# Altium schematic sheet RT-TI DC-DC 5V-LMR14030.SchDoc
size A4
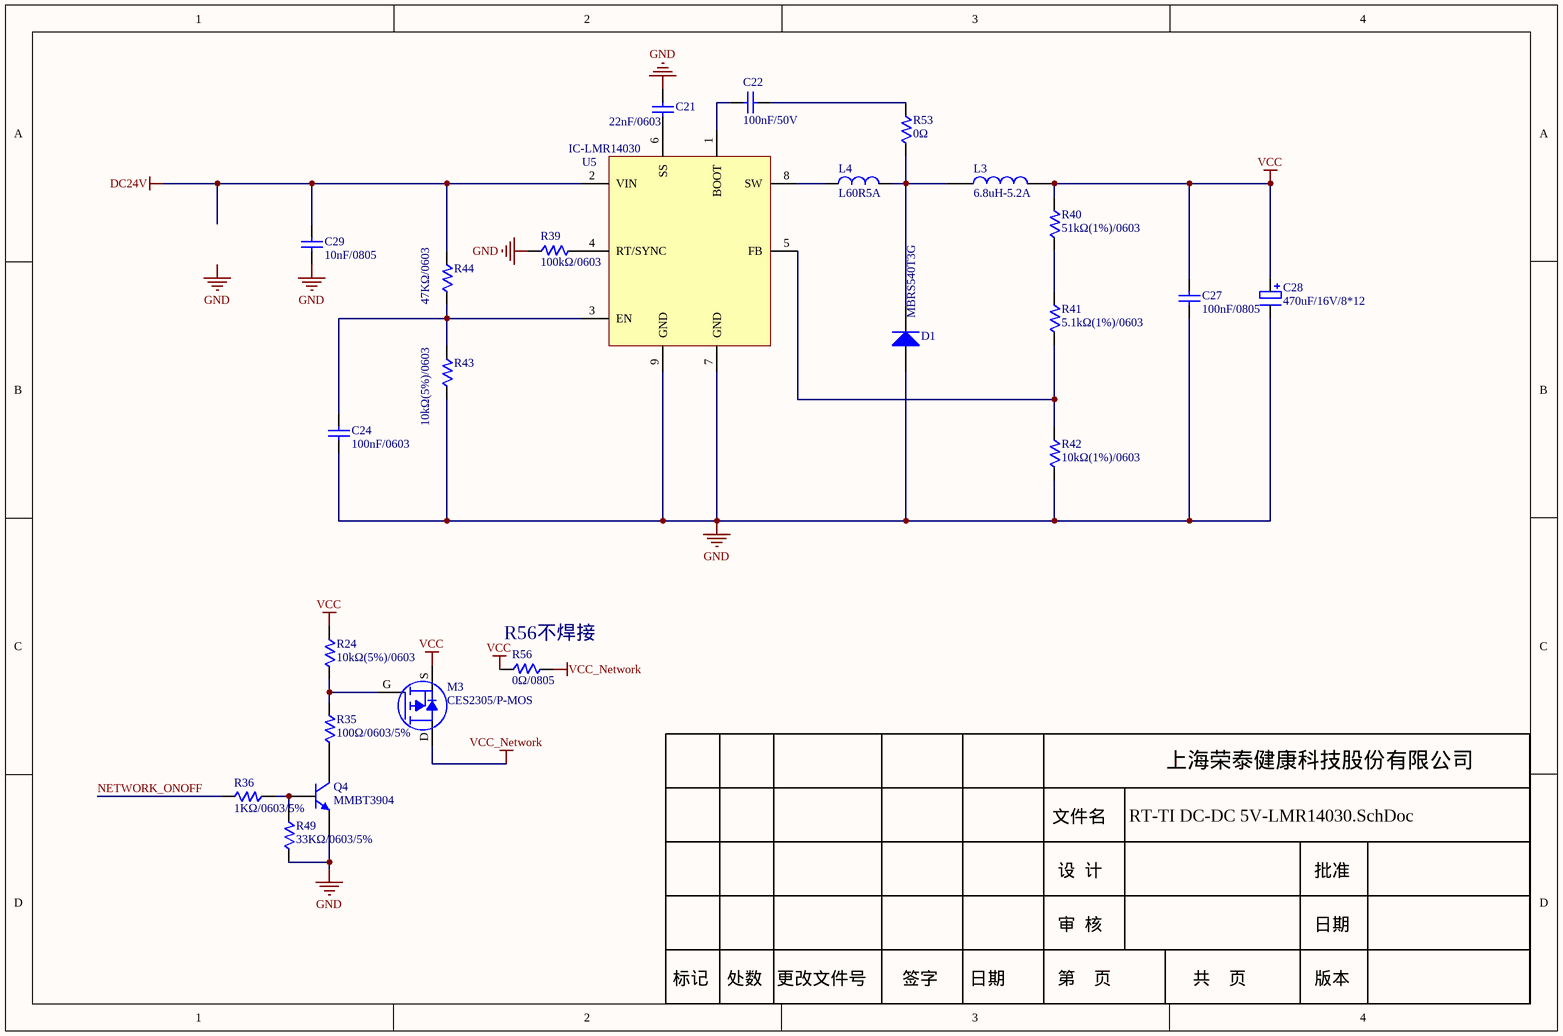
[diagram p0: RT-TI DC-DC 5V-LMR14030.SchDoc]

## Parts
C21  22nF/0603  [0603c]
C22  100nF/50V  [0603C]
C24  100nF/0603  [0603C]
C27  100nF/0805  [0805C]
C28  470uF/16V/8*12  [RB.15/.35]
C29  10nF/0805  [0805C]
D1  MBRS540T3G  [DO-214Ab]
L3  6.8uH-5.2A  [LH-11*11]
L4  L60R5A  [0805L]
M3  CES2305/P-MOS  [SOT-23C]
Q4  MMBT3904  [SOT-23-N]
R24  10kΩ(5%)/0603  [0603]
R35  100Ω/0603/5%  [0603]
R36  1KΩ/0603/5%  [0603]
R39  100kΩ/0603  [0603]
R40  51kΩ(1%)/0603  [0603]
R41  5.1kΩ(1%)/0603  [0603]
R42  10kΩ(1%)/0603  [0603]
R43  10kΩ(5%)/0603  [0603]
R44  47KΩ/0603  [0603]
R49  33KΩ/0603/5%  [0603]
R53  0Ω  [0603]
R56  0Ω/0805  [0805]  (no BOM)
U5  IC-LMR14030  [SO-8-2]

## Nets
DC24V: C29.1 R44.2 U5.2(VIN)
GND: C21.1 C24.1 C27.1 C28.2 C29.2 D1.1(A) Q4.E R39.2 R42.1 R43.1 R49.1 U5.7(GND) U5.9(GND)
VCC: C27.2 C28.1 L3.2 M3.S R24.2 R40.2 R56.2
VCC_Network: M3.D R56.1
NETWORK_ONOFF: R36.1
NetC21_2: C21.2 U5.6(SS)
NetC22_1: C22.1 U5.1(BOOT)
NetC22_2: C22.2 R53.2
NetC24_2: C24.2 R43.2 R44.1 U5.3(EN)
NetD1_2: D1.2(K) L3.1 L4.2 R53.1
NetL4_1: L4.1 U5.8(SW)
NetM3_G: M3.G R24.1 R35.2
NetQ4_B: Q4.B R36.2 R49.2
NetQ4_C: Q4.C R35.1
NetR39_1: R39.1 U5.4(RT/SYNC)
NetR40_1: R40.1 R41.2
NetR41_1: R41.1 R42.2 U5.5(FB)

## Notes on the sheet
- (near R56) R56不焊接
- Labels drawn without touching a wire or pin: GND
- 上海荣泰健康科技股份有限公司
- 文件名
- 设  计
- 批准
- 标记
- 处数
- 更改文件号
- 签字
- 日期
- 审  核
- 第    页
- 共    页
- 版本

## Library data of the parts
C21 = C0603/22nF: 物料名称: 贴片电容22nF/(10%)/X7R/0603封装/环保; 物料编号: 1.01.25.052; 领料单位: 电子车间; 单位: 个; 仓库/库位: 内5X
C22 = C0603/100nF/50V: 物料名称: 贴片电容100nF/(10%)X7R/0603封装/环保; 物料编号: 1.01.25.068; 领料单位: 电子车间; 单位: 个; 仓库/库位: 内5X
C24 = C0603/100nF: 物料名称: 贴片电容104M/(20%)/X7R/0603封装/环保; 物料编号: 1.01.25.056; 领料单位: 电子车间; 单位: 个; 仓库/库位: 内5X
C27 = C0805/104M: 物料名称: 贴片电容104M/50V/0805封装/20%/X7R/环保; 物料编号: 1.01.25.003; 领料单位: 电子车间; 单位: 个; 仓库/库位: 内5X
C28 = 电解电容470uF/16V/8*12/编带/环保: 物料编号: 1.01.21.034; 领料单位: 电子车间; 单位: 个; 仓库/库位: 内5X; 物料名称: 电解电容470uF/16V/8*12/编带/环保
C29 = C0805/103/50V: 物料名称: 贴片电容103/50V/0805封装/10%/X7R/环保; 物料编号: 1.01.25.018; 领料单位: 电子车间; 单位: 个; 仓库/库位: 内5X
D1 = D-MBRS540T3G: 物料名称: 贴片二极管MBRS540T3G/5A 40V/ DO-214AB封装/环保; 物料编号: 新物料; 领料单位: 电子车间; 单位: 个; 仓库/库位: 内5X
L3 = L-6.8uH-5.2A/10*10/环保: 物料名称: 6.8uH-5.2A/贴片功率电感/10*10/环保; 物料编号: 新物料; 领料单位: 电子车间; 单位: 个; 仓库/库位: 内5X
L4 = L0603/60R5A: 物料名称: 贴片磁珠/FBMA-11-201209-600A50T/0805A封装/环保/EMC; 物料编号: 1.01.51.080; 领料单位: 电子车间; 单位: 个; 仓库/库位: 内5X
M3 = P沟道mos管CES2305封装SOT-23/环保: 物料编号: 1.01.40.512; 物料名称: P沟道mos管CES2305封装SOT-23/环保
Q4 = Q-MMBT3904/1AM-N: 物料名称: 贴片三极管1AM/MMBT3904/sot-23封装环保; 物料编号: 1.01.33.013; 领料单位: 电子车间; 单位: 个; 仓库/库位: 内5X
R24 R43 = R0603/10kΩ/(5%): 物料编号: 1.01.15.105; 物料名称: 贴片电阻10kΩ/(5%)0603封装/环保; 领料单位: 个; 仓库/库位: 内5X
R35 = 贴片电阻100Ω/(5%)0603封装: 物料编号: 1.01.15.103; 领料单位: 电子车间; 仓库/库位: 内5X; 单位: 个; 物料名称: 贴片电阻100Ω/(5%)0603封装
R36 = 贴片电阻1K/(5%)/0603封装/环保: 物料编号: 1.01.15.111; 领料单位: 电子车间; 单位: 个; 仓库/库位: 内5X; 物料名称: 贴片电阻1K/(5%)/0603封装/环保
R39 = R0603/100K: 物料编号: 1.01.15.123; 物料名称: 贴片电阻100kΩ(1%)/0603封装/环保; 领料单位: 电子车间; 单位: 个; 仓库/库位: 内5X
R40 = R0603/51kΩ(1%): 物料编号: 新物料; 物料名称: 贴片电阻51kΩ(1%)/0603封装/环保; 领料单位: 电子车间; 单位: 个; 仓库/库位: 内5X
R41 = R0603/5.1kΩ(1%): 物料编号: 新物料; 物料名称: 贴片电阻5.1kΩ(1%)/0603封装/环保; 领料单位: 电子车间; 单位: 个; 仓库/库位: 内5X
R42 = R0603/10kΩ(1%): 物料编号: 1.01.15.112; 物料名称: 贴片电阻10kΩ(1%)/0603封装/环保; 领料单位: 电子车间; 单位: 个; 仓库/库位: 内5X
R44 = R0603/47KΩ: 物料编号: 新物料; 物料名称: 贴片电阻47KΩ/0603封装/环保; 领料单位: 电子车间; 单位: 个; 仓库/库位: 内5X
R49 = 贴片电阻33K/(5%)/0603封装/环保: 物料编号: 1.01.15.117; 领料单位: 电子车间; 仓库/库位: 内5X; 单位: 个; 物料名称: 贴片电阻33K/(5%)/0603封装/环保
R53 = R0603/0Ω: 物料编号: 1.01.15.124; 物料名称: 贴片电阻0Ω/(5%)/0603封装/环保; 领料单位: 电子车间; 单位: 个; 仓库/库位: 内5X
R56 = 贴片电阻0Ω/0805封装/环保: 物料编号: 1.01.15.004; 领料单位: 电子车间; 仓库/库位: 内5X; 单位: 个; 物料名称: 贴片电阻0Ω/0805封装/环保
U5 = IC-LMR14030/SO-8: 物料名称: DC-DC降压芯片LMR14030/4V-40V-3.5A; 物料编号: 新物料; 领料单位: 电子车间; 单位: 个; 仓库/库位: 内5X